# EAGLE design MainSensor (EAGLE 6.4)
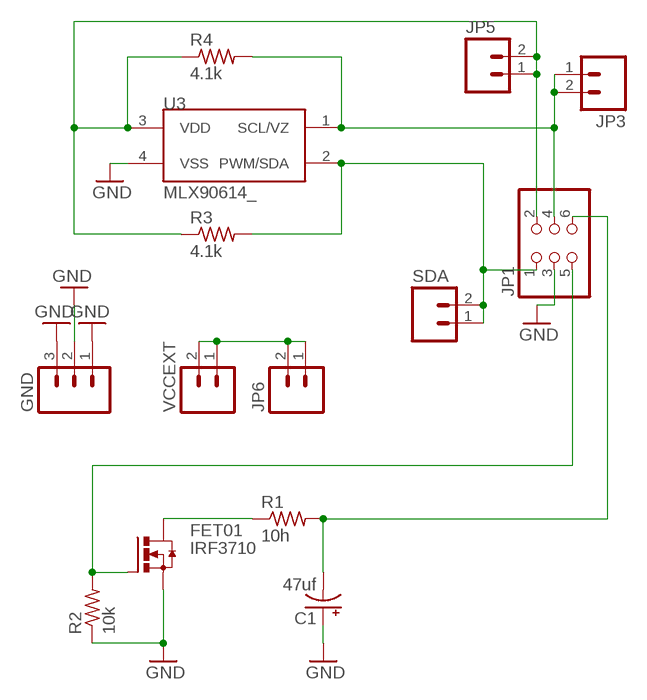
[diagram p0: schematic, sheet 1]

## Parts
C1  47uf  CPOL-USE2,5-6E  [E2,5-6E]
FET01  IRF3710  IRF3704  [TO220AH]
GND  M03LONGPADS  [1X03_LONGPADS]
JP1  PINHD-2X3  [2X03]
JP3  M02LOCK_LONGPADS  [1X02_LOCK_LONGPADS]
JP5  M02LOCK_LONGPADS  [1X02_LOCK_LONGPADS]
JP6  M02LOCK_LONGPADS  [1X02_LOCK_LONGPADS]
R1  10h  R-US_0207/7  [0207/7]
R2  10k  R-US_0207/7  [0207/7]
R3  4.1k  R-US_0204/5  [0204/5]
R4  4.1k  R-US_0204/5  [0204/5]
SDA  M02LOCK_LONGPADS  [1X02_LOCK_LONGPADS]
U3  MLX90614_  [TO-39]
VCCEXT  M02LOCK_LONGPADS  [1X02_LOCK_LONGPADS]

## Nets
GND: C1.+ FET01.E(S) GND.1 GND.2 GND.3 JP1.3 R2.1 U3.4(VSS)
N$1: JP6.1 JP6.2 VCCEXT.1 VCCEXT.2
N$2: FET01.C(D) R1.1
N$3: C1.- JP1.6 R1.2
N$15: JP1.4 JP3.1 JP3.2 R4.2 U3.1(SCL/VZ)
N$16: JP1.1 R3.2 SDA.1 SDA.2 U3.2(PWM/SDA)
N$18: FET01.B(G) JP1.5 R2.2
VCC3: JP1.2 JP5.1 JP5.2 R3.1 R4.1 U3.3(VDD)

## Library data of the parts
C1 = rcl:CPOL-US: POLARIZED CAPACITOR, American symbol
FET01 = transistor-power:IRF3704: SMPS MOSFET HEXFET® Power MOSFET Source: http://www.irf.com/product-info/datasheets/data/irf3704.pdf
GND = SparkFun-Connectors:M03: Header 3 Standard 3-pin 0.1" header. Use with straight break away headers (SKU : PRT-00116), right angle break away headers (PRT-00553), swiss pins (PRT-00743), machine pins (PRT-00117), and female headers (PRT-00115). Molex polarized connector foot print use with SKU : PRT-08232 with associated crimp pins and housings.
JP1 = SparkFun-Connectors:PINHD-2X3: PIN HEADER
JP3 JP5 JP6 SDA VCCEXT = SparkFun-Connectors:M02: Header 2 Standard 2-pin 0.1" header. Use with straight break away headers (SKU : PRT-00116), right angle break away headers (PRT-00553), swiss pins (PRT-00743), machine pins (PRT-00117), and female headers (PRT-00115). Molex polarized connector foot print use with SKU : PRT-08233 with associated crimp pins and housings.
R1-R4 = rcl:R-US_: RESISTOR, American symbol
U3 = SparkFun-Sensors:MLX90614: Non-contact PIR I2C interface temperature sensor

## Board
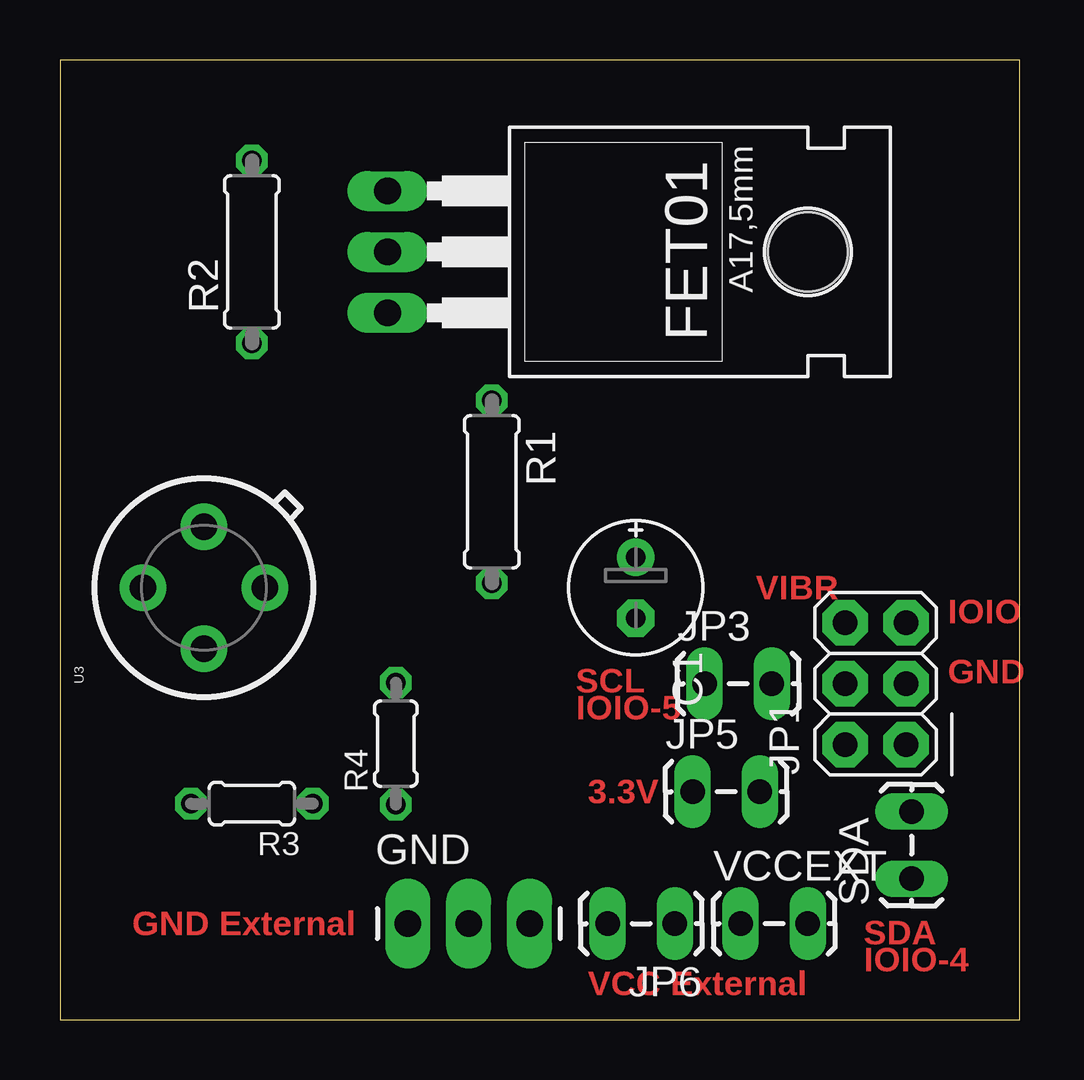
[diagram p1: board, top side]
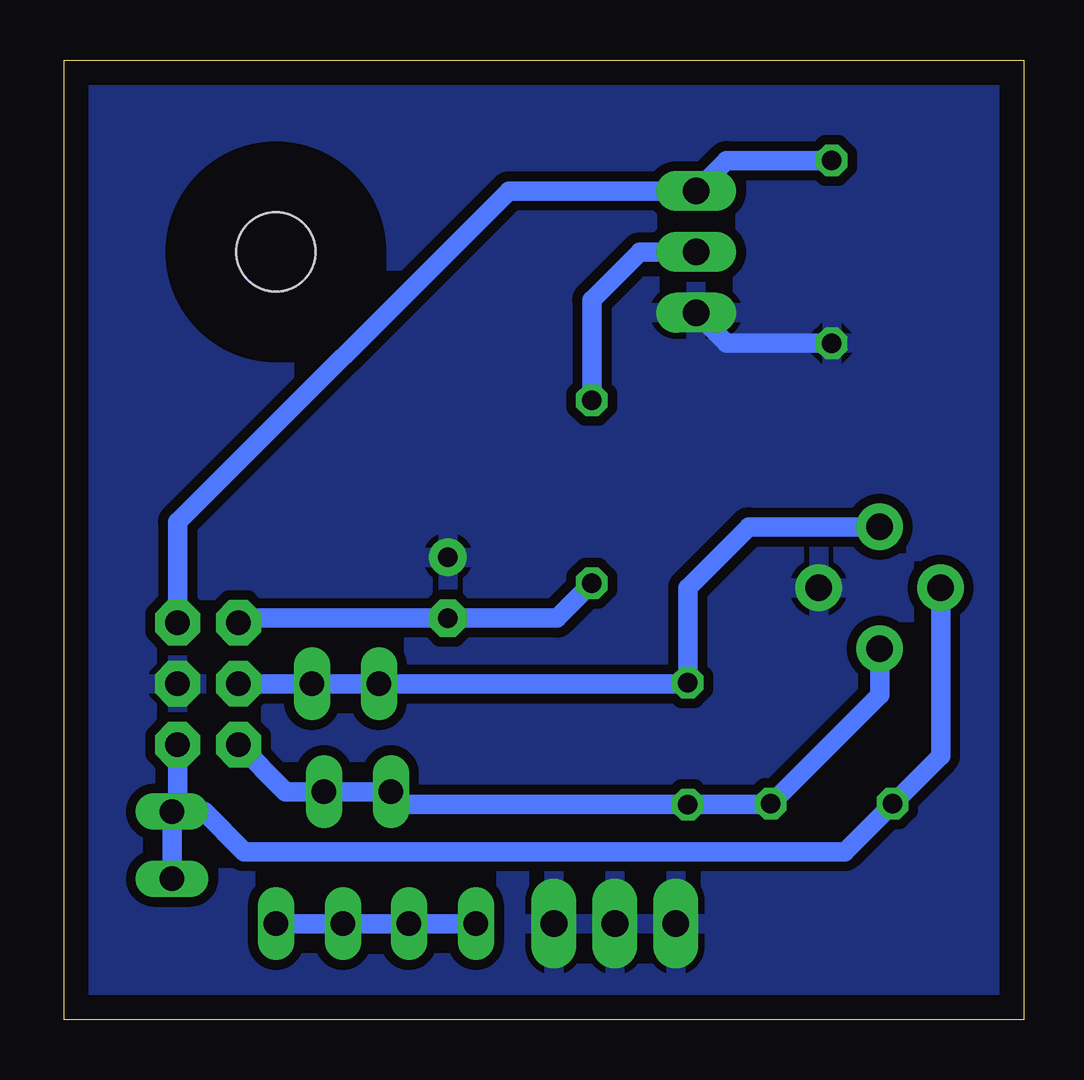
[diagram p2: board, bottom side, seen from below]

Size 40 x 40 mm. Coordinates in mm from the lower left corner, seen from the top.
Outline: 0,0 40,0 40,40 0,40 0,0
Copper layers (1*16): Top 0.035mm / dielectric 1.5mm / Bottom 0.035mm
Design rules "default": minimum track width 10mil, minimum drill 24mil, track to track 8mil, track to pad 8mil, pad to pad 8mil, via to via 8mil, smd to smd 8mil, copper to edge 40mil, drill to drill 8mil, minimum pad ring 10mil, minimum via ring 8mil, stop-mask expansion 4mil, vias tented up to drill 0mil, thermal gap 10mil

### Footprints (pad centres in the part's own frame; a part is rotated, then mirrored left to right if it is on the bottom)
E2,5-6E = drill 0.813 pad 1.575: + -1.27,0 | drill 0.813 pad 1.575 octagon: - 1.27,0
TO220AH = drill 1.118 long: B -2.54,-6.35; C 0,-6.35; E 2.54,-6.35 | hole 3.302: 0,11.176
1X03_LONGPADS = drill 1.118 pad 1.88 long: 1 0,0; 2 2.54,0; 3 5.08,0
2X03 = drill 1.016 pad 1.88 octagon: 1 -2.54,-1.27; 2 -2.54,1.27; 3 0,-1.27; 4 0,1.27; 5 2.54,-1.27; 6 2.54,1.27
1X02_LOCK_LONGPADS = drill 1.016 long: 1 -0.127,0; 2 2.667,0
0207/7 = drill 0.813 octagon: 1 -3.81,0; 2 3.81,0
0204/5 = drill 0.813 octagon: 1 -2.54,0; 2 2.54,0
TO-39 = drill 1.1 pad 1.93: 1 2.54,0; 2 0,2.54; 3 -2.54,0; 4 0,-2.54

### Placement (x,y rotation side)
C1  24,18 270 top
FET01  20,32 270 top
GND  14.5,4 0 top
JP1  34,14 90 top
JP3  27,14 0 top
JP5  26.5,9.5 0 top
JP6  25.5,4 180 top
R1  18,22 270 top
R2  8,32 90 top
R3  8,9 180 top
R4  14,11.5 90 top
SDA  35.5,6 90 top
U3  6,18 90 top
VCCEXT  28.5,4 0 top

### Tracks (layer width: path | path; a pad name or v marks a point on that pad's centre or on a via)
GND
  Bottom 0.813: FET01.E 12.38,28.19 R2.1 | GND.1 14.75,3.87
  pour Bottom (isolate 0.406): 0,40 40,40 40,0 0,0
N$1
  Bottom 0.813: VCCEXT.2 VCCEXT.1 JP6.1 JP6.2
N$2
  Bottom 0.813: FET01.C 16,32 18,30 R1.1
N$3
  Bottom 0.813: R1.2 19.46,16.73 C1.- 32.54,16.73 JP1.6
N$15
  Bottom 0.813: U3.1 11.46,20.54 14,18 R4.2 14.04,14 JP3.1 JP3.2 JP1.4
N$16
  Bottom 0.813: SDA.2 SDA.1 | U3.2 3.46,11 R3.2 7.46,7 32.5,7 34.17,8.67 SDA.2 | JP1.1 35.27,8.9 SDA.2
N$18
  Bottom 0.813: R2.2 12.38,35.81 FET01.B 21.46,34.54 35.27,20.73 JP1.5
VCC3
  Bottom 0.813: JP5.1 27,9.5 | 27,9.5 JP5.2 30.77,9.5 JP1.2 | U3.3 6,13.54 R3.1 10.58,8.96 R4.1 26.46,8.96 27,9.5

### Text on the board
Top: VIBR | IOIO | GND | SCL / IOIO-5 | 3.3V | GND External | SDA / IOIO-4 | VCC External